# EAGLE design Antenna Board (EAGLE 9.6.2)
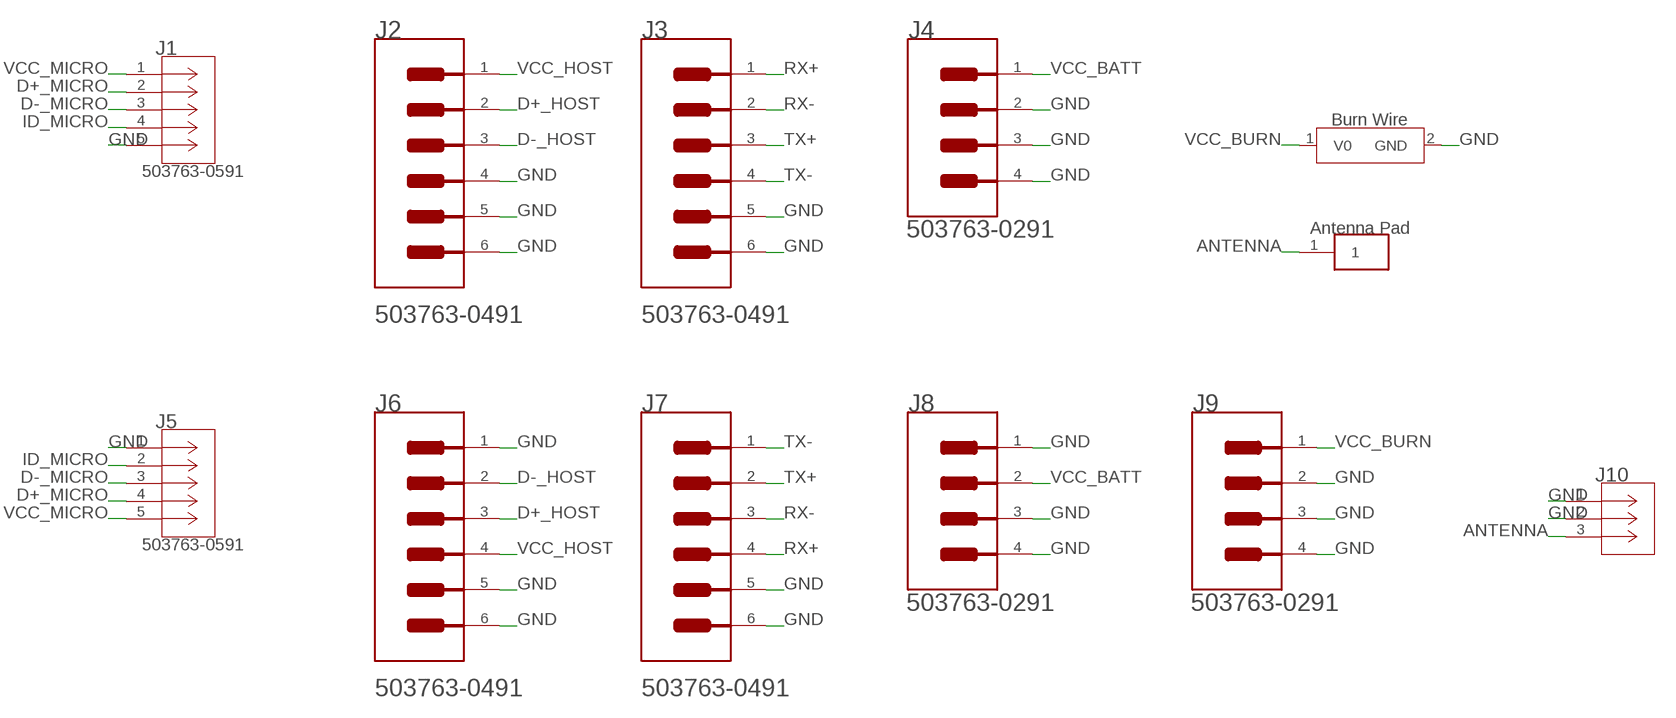
[diagram p0: schematic, sheet 1]

## Parts
J1  503763-0591  [CONN_5037630591_MOL]
J2  MOLEX_503763-0491MOLEX_503763-0491_0_0  [MOLEX_503763-0491_0]
J3  MOLEX_503763-0491MOLEX_503763-0491_0_0  [MOLEX_503763-0491_0]
J4  MOLEX_503763-0291MOLEX_503763-0291_0_0  [MOLEX_503763-0291_0]
J5  503763-0591  [CONN_5037630591_MOL]
J6  MOLEX_503763-0491MOLEX_503763-0491_0_0  [MOLEX_503763-0491_0]
J7  MOLEX_503763-0491MOLEX_503763-0491_0_0  [MOLEX_503763-0491_0]
J8  MOLEX_503763-0291MOLEX_503763-0291_0_0  [MOLEX_503763-0291_0]
J9  MOLEX_503763-0291MOLEX_503763-0291_0_0  [MOLEX_503763-0291_0]
J10  U.FL-R-SMT-1(01)  [CONN_-SMT-1(01)]
U$2  ANTENNA_PAD  [ANTENNA_PAD]
U$3  BURNWIRE  [BURNWIRE]

## Nets
ANTENNA: J10.3 U$2.1
D+_HOST: J2.2 J6.3
D+_MICRO: J1.2 J5.4
D-_HOST: J2.3 J6.2
D-_MICRO: J1.3 J5.3
GND: J1.5 J2.4 J2.5(MNT_1) J2.6(MNT_2) J3.5(MNT_1) J3.6(MNT_2) J4.2 J4.3(MNT_1) J4.4(MNT_2) J5.1 J6.1 J6.5(MNT_1) J6.6(MNT_2) J7.5(MNT_1) J7.6(MNT_2) J8.1 J8.3(MNT_1) J8.4(MNT_2) J9.2 J9.3(MNT_1) J9.4(MNT_2) J10.1 J10.2 U$3.2(GND)
ID_MICRO: J1.4 J5.2
RX+: J3.1 J7.4
RX-: J3.2 J7.3
TX+: J3.3 J7.2
TX-: J3.4 J7.1
VCC_BATT: J4.1 J8.2
VCC_BURN: J9.1 U$3.1(V0)
VCC_HOST: J2.1 J6.4
VCC_MICRO: J1.1 J5.5

## Library data of the parts
J1 J5 = Molex - 503763-0591:503763-0591; BUILT_BY: EMA_Cory; COPYRIGHT: Copyright (C) 2018 Accelerated Designs. All rights reserved; DATASHEET: https://www.molex.com/pdm_docs/sd/5037630591_sd.pdf; MANUFACTURER_PART_NUMBER: 503763-0591; SOURCELIBRARY: Add_to_database_2020-12-14; VENDOR: Molex Connector Corporation
J2 J3 J6 J7 = Molex - 503763-0491:MOLEX_503763-0491: Wire-To-Board Connector, Pico-Lock 503763 Series, Surface Mount, Header, 4 Contacts, 1 mm; AUTOMOTIVE: No; CENTROID_NOT_SPECIFIED: No; CONN_GENDER: Male; CONN_ORIENTATION: Right Angle; CONTACT_MATERIAL: Gold,Nickel; CURRENT_RATING: 1.5A; DATASHEET: https://www.molex.com/webdocs/datasheets/pdf/en-us/5037630491_PCB_HEADERS.pdf; DEVICE_CLASS_L1: Connectors; DEVICE_CLASS_L2: Headers and Wire Housings; DEVICE_CLASS_L3: unset; DIGIKEY_DESCRIPTION: CONN HEADER 1MM R/A 4CKT; DIGIKEY_PART_NUMBER: WM10655CT-ND; FOOTPRINT_URL: https://www.molex.com/pdm_docs/sd/5037630491_sd.pdf; FOOTPRINT_VARIANT_NAME_0: Recommended_Land_Pattern; HEIGHT: 1.7mm; LEAD_FREE: Yes; MF: Molex; MFG_PACKAGE_IDENT: 503763-0491; MFG_PACKAGE_IDENT_DATE: 0; MFG_PACKAGE_IDENT_REV: 0; MOUSER_PART_NUMBER: 538-503763-0491; MPN: 503763-0491; NUMBER_OF_CONTACTS: 4; NUMBER_OF_ROWS: 1; PACKAGE: HDR4; PITCH: 1mm; PREFIX: J; ROHS: Yes; TEMPERATURE_RANGE_HIGH: +105°C; TEMPERATURE_RANGE_LOW: -40°C; VERIFICATION_VERSION: 0.0.0.1; VOLTAGE_RATING: 150V
J4 J8 J9 = Molex - 503763-0291:MOLEX_503763-0291: 2 Positions Header Connector 0.039" (1.00mm) Surface Mount, Right Angle Gold; CENTROID_NOT_SPECIFIED: No; DATASHEET: http://www.molex.com/pdm_docs/sd/5037630291_sd.pdf; DIGIKEY_DESCRIPTION: CONN HEADER 1MM R/A 2CKT; DIGIKEY_PART_NUMBER: WM10654CT-ND; LEAD_FREE: yes; MF: Molex; MOUSER_PART_NUMBER: 538-503763-0291; MPN: 503763-0291; PACKAGE: HDR02; PREFIX: J; ROHS: yes; TEMPERATURE_RANGE_HIGH: +105°C; TEMPERATURE_RANGE_LOW: -40°C
J10 = U.FL-R-SMT-1(01):U.FL-R-SMT-1(01); BUILT_BY: EMA_Matt; COPYRIGHT: Copyright (C) 2018 Accelerated Designs. All rights reserved; MANUFACTURER_PART_NUMBER: U.FL-R-SMT-1(01); SOURCELIBRARY: Hirose_12_20_2019; VENDOR: Hirose
U$2 = Antenna_Pad:ANTENNA_PAD
U$3 = Burn_Wire:BURNWIRE

## Board
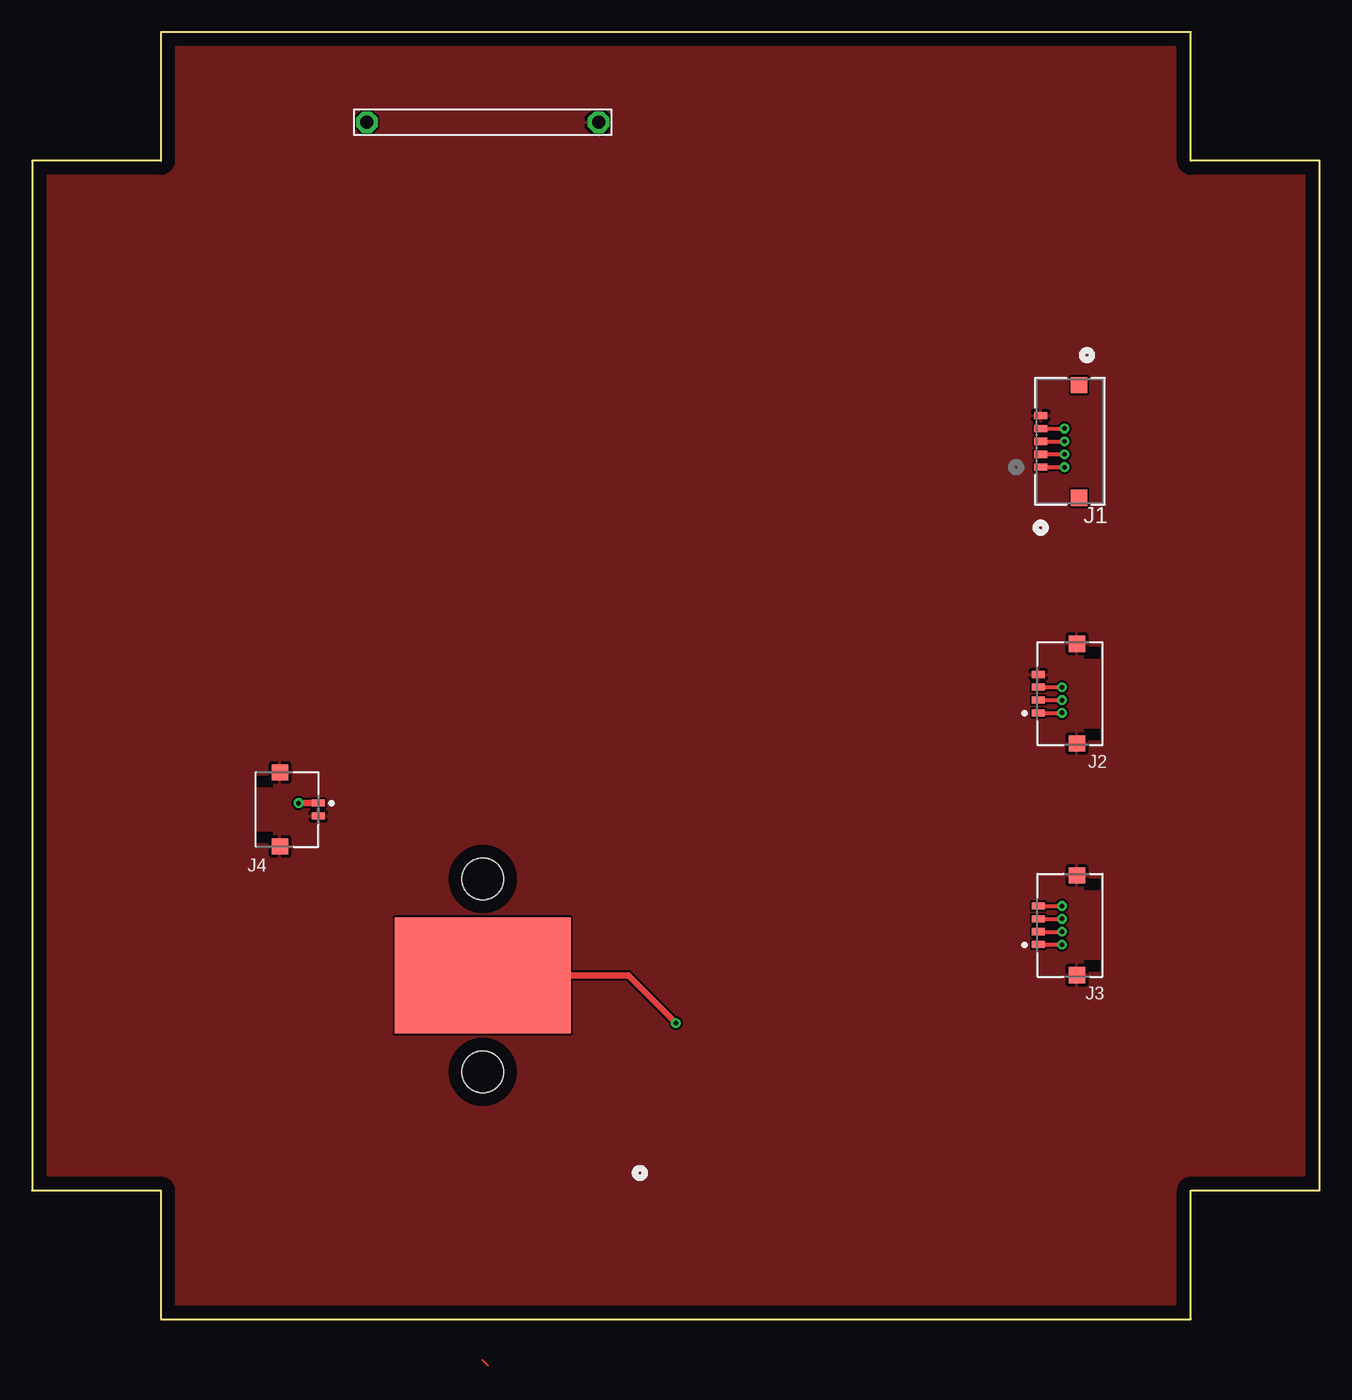
[diagram p1: board, top side]
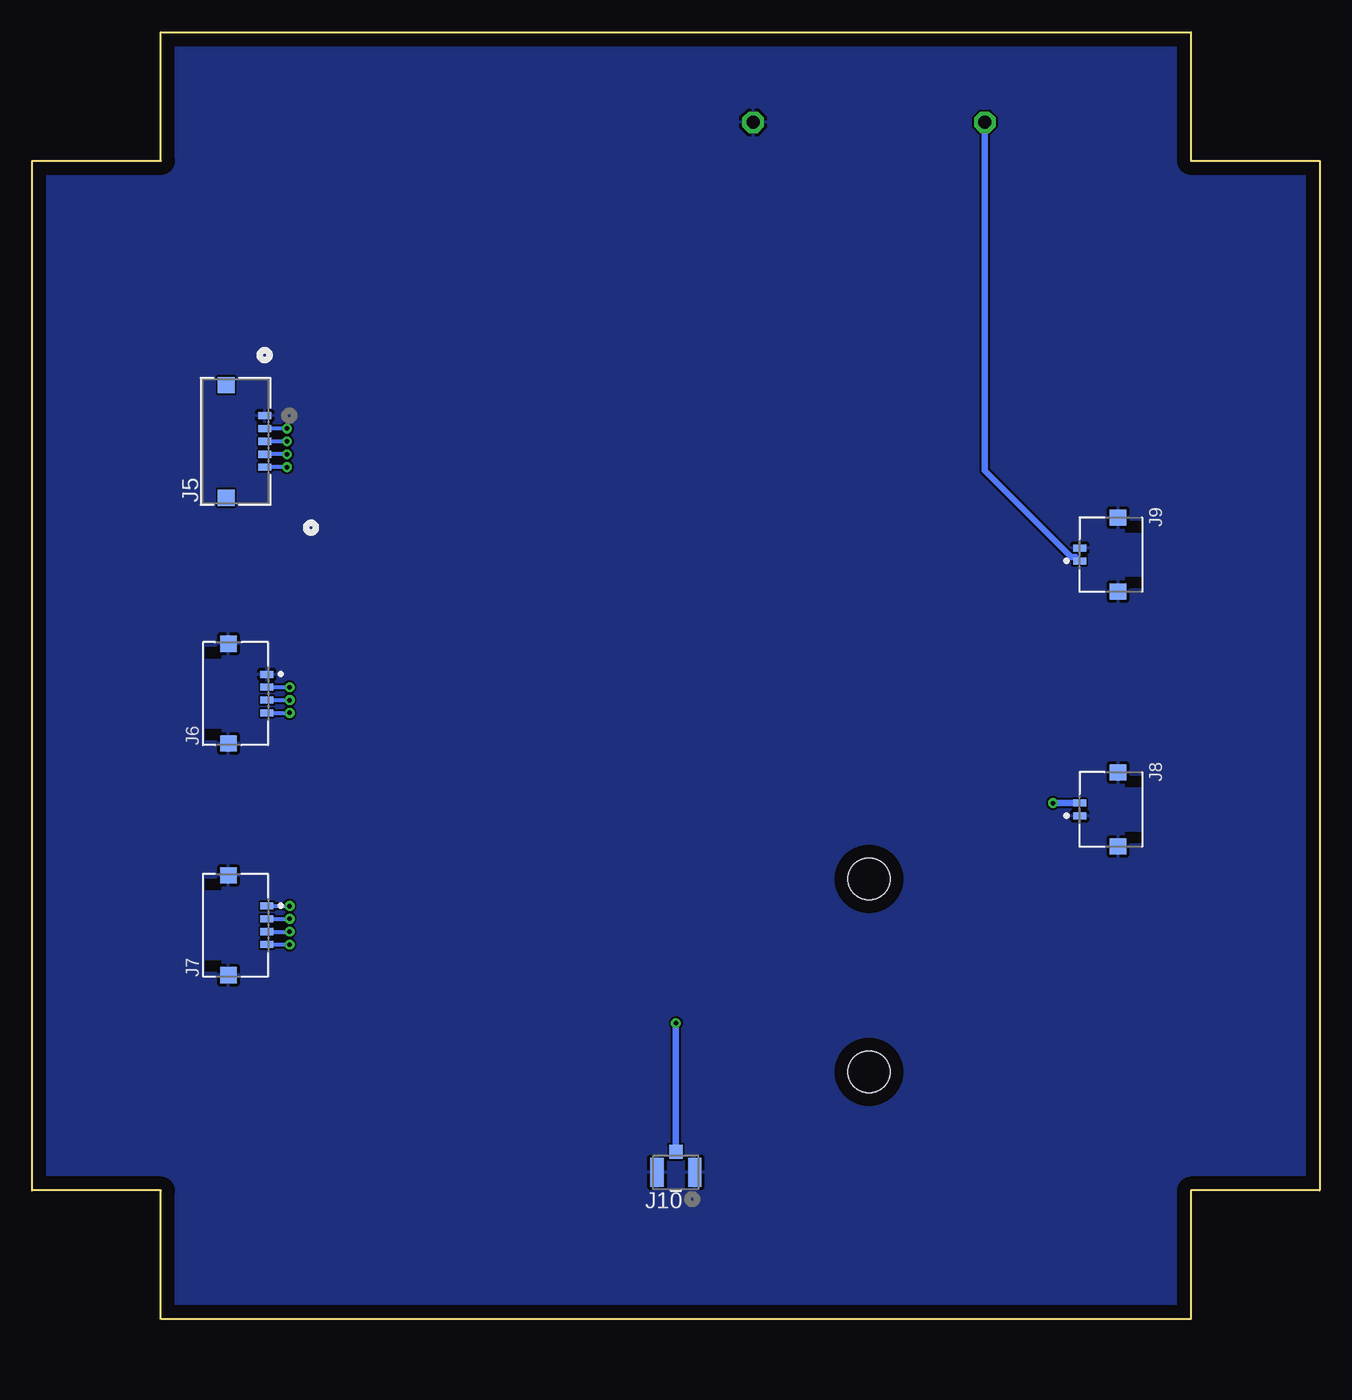
[diagram p2: board, bottom side, seen from below]

Size 100 x 100 mm. Coordinates in mm from the lower left corner, seen from the top.
Outline: 0,10 10,10 10,0 90,0 90,10 100,10 100,90 90,90 90,100 10,100 10,90 0,90 0,10
Copper layers (1*16): Top 0.035mm / dielectric 1.5mm / Bottom 0.035mm
Design rules "default": minimum track width 6mil, minimum drill 0.35mm, track to track 6mil, track to pad 6mil, pad to pad 6mil, via to via 6mil, smd to smd 6mil, copper to edge 40mil, drill to drill 6mil, minimum pad ring 10mil, minimum via ring 8mil, stop-mask expansion 4mil, vias tented up to drill 0mil, thermal gap 10mil
Holes 3.26 mm at 35,19.2 35,34.2

### Footprints (pad centres in the part's own frame; a part is rotated, then mirrored left to right if it is on the bottom)
CONN_5037630591_MOL = smd 0.559 x 0.991: 1 -2,2.261; 2 -1,2.261; 3 0,2.261; 4 1,2.261; 5 2,2.261 | smd 1.27 x 1.295: 6 -4.375,-0.729; 7 4.375,-0.729
MOLEX_503763-0491_0 = smd 0.55 x 1: 1 1.5,-2.435; 2 0.5,-2.435; 3 -0.5,-2.435; 4 -1.5,-2.435 | smd 1.26 x 1.3: 5 -3.875,0.555; 6 3.875,0.555
MOLEX_503763-0291_0 = smd 0.55 x 1: 1 0.5,-2.435; 2 -0.5,-2.435 | smd 1.26 x 1.3: 3 -2.875,0.555; 4 2.875,0.555
CONN_-SMT-1(01) = smd 1.041 x 2.261: 1 -1.47,0; 2 1.47,0 | smd 1.041 x 1.092: 3 0,-1.596
ANTENNA_PAD = smd 13.7 x 9: 1 0,0
BURNWIRE = drill 1 pad 1.676 octagon: 1 -9,0; 2 9,0

### Placement (x,y rotation side)
J1  80.6,68.2 90 top
J2  80.6,48.6 270 top
J3  80.6,30.6 270 top
J4  19.8,39.6 90 top
J5  84.2,68.2 270 bottom
J6  84.2,48.6 90 bottom
J7  84.2,30.6 90 bottom
J8  16.2,39.6 270 bottom
J9  16.2,59.4 270 bottom
J10  50,11.4 180 bottom
U$2  35,26.7 0 top
U$3  35,93 0 top

### Tracks (layer width: path | path; a pad name or v marks a point on that pad's centre or on a via)
ANTENNA  (via drill 0.35)
  Top 0.508: U$2.1 46.3,26.7 v50,23
  Bottom 0.508: J10.3 v50,23
D+_HOST  (via drill 0.35)
  Top 0.305: J2.2 v80,48.1
  Bottom 0.305: J6.3 v80,48.1
D+_MICRO  (via drill 0.35)
  Top 0.305: J1.2 v80.2,67.2
  Bottom 0.305: v80.2,67.2 J5.4
D-_HOST  (via drill 0.35)
  Top 0.305: J2.3 v80,49.1
  Bottom 0.305: J6.2 v80,49.1
D-_MICRO  (via drill 0.35)
  Top 0.305: J1.3 v80.2,68.2
  Bottom 0.305: v80.2,68.2 J5.3
GND
  Top 0.152: J2.5 81.16,52.16
  pour Top: -1,101 101,101 101,-1 -1,-1
  pour Bottom: -2,102 102,102 102,-2 -2,-2
ID_MICRO  (via drill 0.35)
  Top 0.305: J1.4 v80.2,69.2
  Bottom 0.305: v80.2,69.2 J5.2
N$1
  Top 0.152: 35,-3.2 35.4,-3.6
RX+  (via drill 0.35)
  Top 0.305: J3.1 v80,29.1
  Bottom 0.305: J7.4 v80,29.1
RX-  (via drill 0.35)
  Top 0.305: J3.2 v80,30.1
  Bottom 0.305: J7.3 v80,30.1
TX+  (via drill 0.35)
  Top 0.305: J3.3 v80,31.1
  Bottom 0.305: J7.2 v80,31.1
TX-  (via drill 0.35)
  Top 0.305: J3.4 v80,32.1
  Bottom 0.305: J7.1 v80,32.1
VCC_BATT  (via drill 0.35)
  Top 0.508: J4.1 v20.7,40.1
  Bottom 0.508: v20.7,40.1 J8.2
VCC_BURN
  Bottom 0.508: J9.1 18.95,59.22 19.3,59.22 26,65.92 U$3.1
VCC_HOST  (via drill 0.35)
  Top 0.305: J2.1 v80,47.1
  Bottom 0.305: J6.4 v80,47.1
VCC_MICRO  (via drill 0.35)
  Top 0.305: J1.1 v80.2,66.2
  Bottom 0.305: v80.2,66.2 J5.5